# Altium schematic sheet main.SchDoc
size A; SheetNumber: 1; SheetTotal: 4
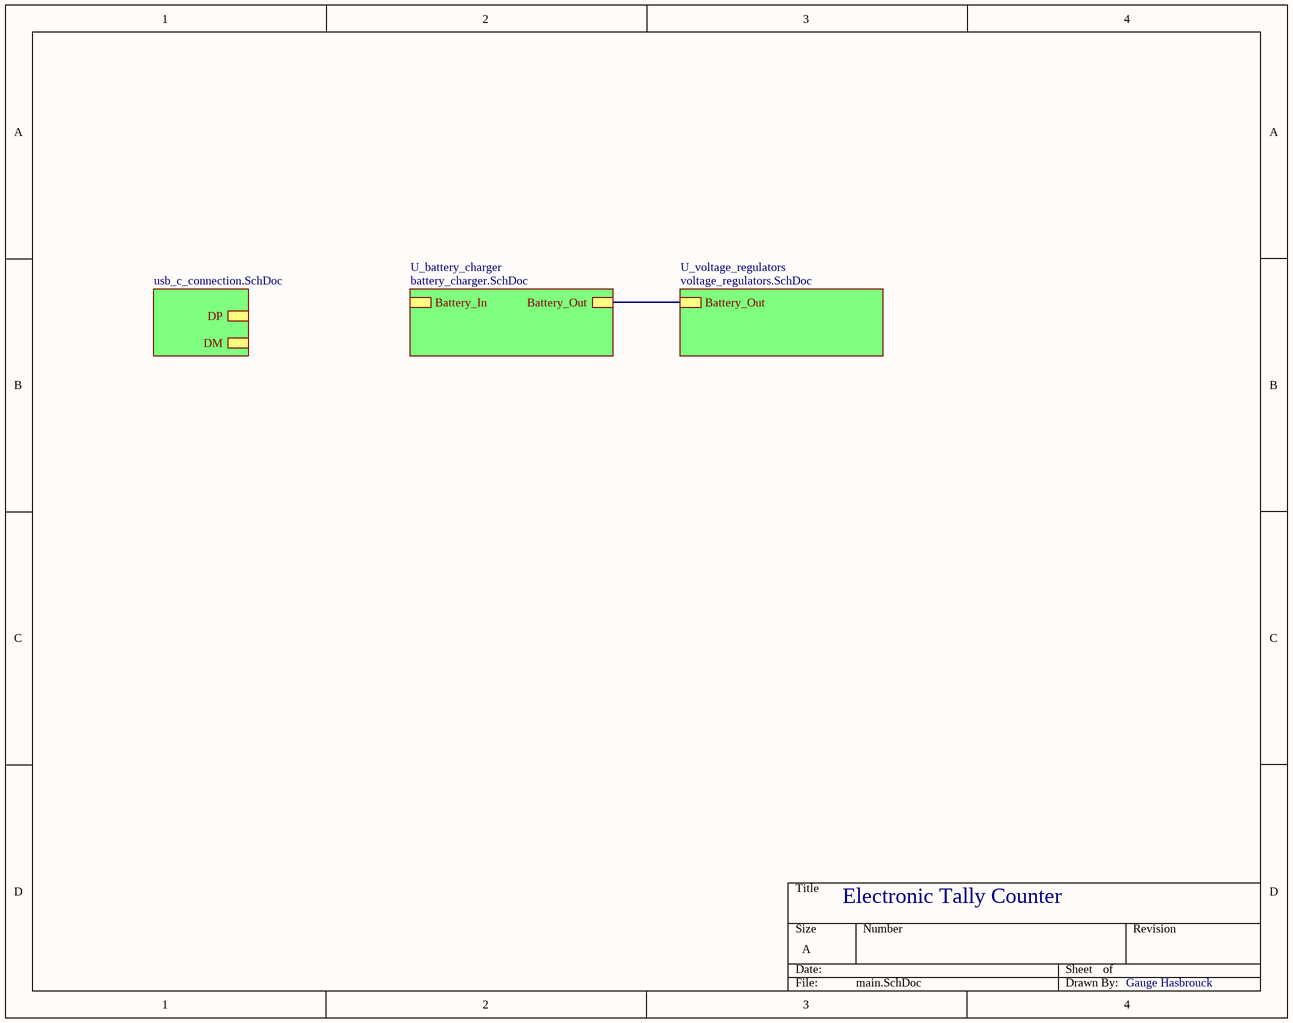
[diagram p0: main.SchDoc]

## Sub-sheets
U_battery_charger = battery_charger.SchDoc: Battery_In, Battery_Out
U_usb_c_connection = usb_c_connection.SchDoc: DP, DM
U_voltage_regulators = voltage_regulators.SchDoc: Battery_Out

## Nets
(unnamed): sheet U_battery_charger/Battery_Out, sheet U_voltage_regulators/Battery_Out

## Notes on the sheet
- Electronic Tally Counter
- Gauge Hasbrouck